# EAGLE design Led_amp (EAGLE 9.6.0)
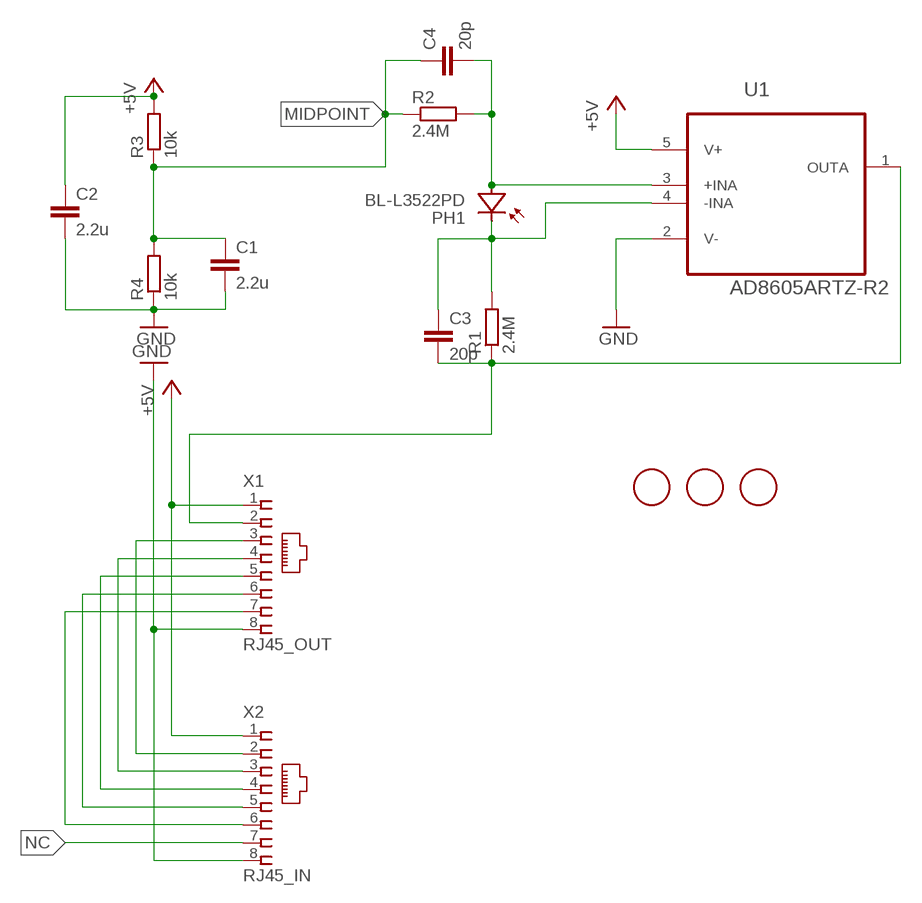
[diagram p0: schematic, sheet 1]

## Parts
C1  2.2u  C-EUC0805  [C0805]
C2  2.2u  C-EUC0805  [C0805]
C3  20p  C-EUC0805  [C0805]
C4  20p  C-EUC0805  [C0805]
PH1  BL-L3522PD  [PDOTODIODE_RECT]
R1  2.4M  R-EU_R0805  [R0805]
R2  2.4M  R-EU_R0805  [R0805]
R3  10k  R-EU_R0805  [R0805]
R4  10k  R-EU_R0805  [R0805]
U1  AD8605ARTZ-R2  [SOT95P290X145-5N]
U$1  FIDUCIALLARGE_1MM  [FIDUCIAL_1MM_LARGE]
U$2  FIDUCIALLARGE_1MM  [FIDUCIAL_1MM_LARGE]
U$3  FIDUCIALLARGE_1MM  [FIDUCIAL_1MM_LARGE]
X1  RJ45_OUT  RJ45DS1134  [DS1134]
X2  RJ45_IN  RJ45DS1134  [DS1134]

## Nets
+5V: C2.1 R3.2 U1.5(V+) X1.1 X2.1
GND: C1.2 C2.2 R4.1 U1.2(V-) X1.8 X2.8
IN+: C4.2 PH1.A R2.2 U1.3(+INA)
IN-: C3.1 PH1.K(C) R1.2 U1.4(-INA)
MIDPOINT: C1.1 C4.1 R2.1 R3.1 R4.2
NC: X2.7
OUT: C3.2 R1.1 U1.1(OUTA) X1.2
OUT2: X1.3 X2.2
OUT3: X1.4 X2.3
OUT4: X1.5 X2.4
OUT5: X1.6 X2.5
OUT6: X1.7 X2.6

## Library data of the parts
C1-C4 = rcl:C-EU: CAPACITOR, European symbol; SPICEPREFIX: C
PH1 = LedAmp:BL-L3522PD
R1-R4 = rcl:R-EU_: RESISTOR, European symbol; SPICEPREFIX: R
U1 = AD8605ARTZ-R2:AD8605ARTZ-R2: Precision, Low Noise, CMOS, RRIO Op Amp; AVAILABILITY: Unavailable; DESCRIPTION: General Purpose Amplifier 1 Circuit Rail-to-Rail SOT-23-5; MF: Analog Devices; MP: AD8605ARTZ-REEL7; PACKAGE: SOT-23-5 Analog Devices; PRICE: None
U$1-U$3 = LedAmp:FIDUCIAL: For use by pick and place machines to calibrate the vision/machine, 1mm By microbuilder.eu
X1 X2 = LedAmp:RJ45: CORCOM Modular RJ Jacks No Shield Source: www.tycoelectronics.com .. ENG_DS_1654001_1099_RJ_L_0507.pdf

## Board
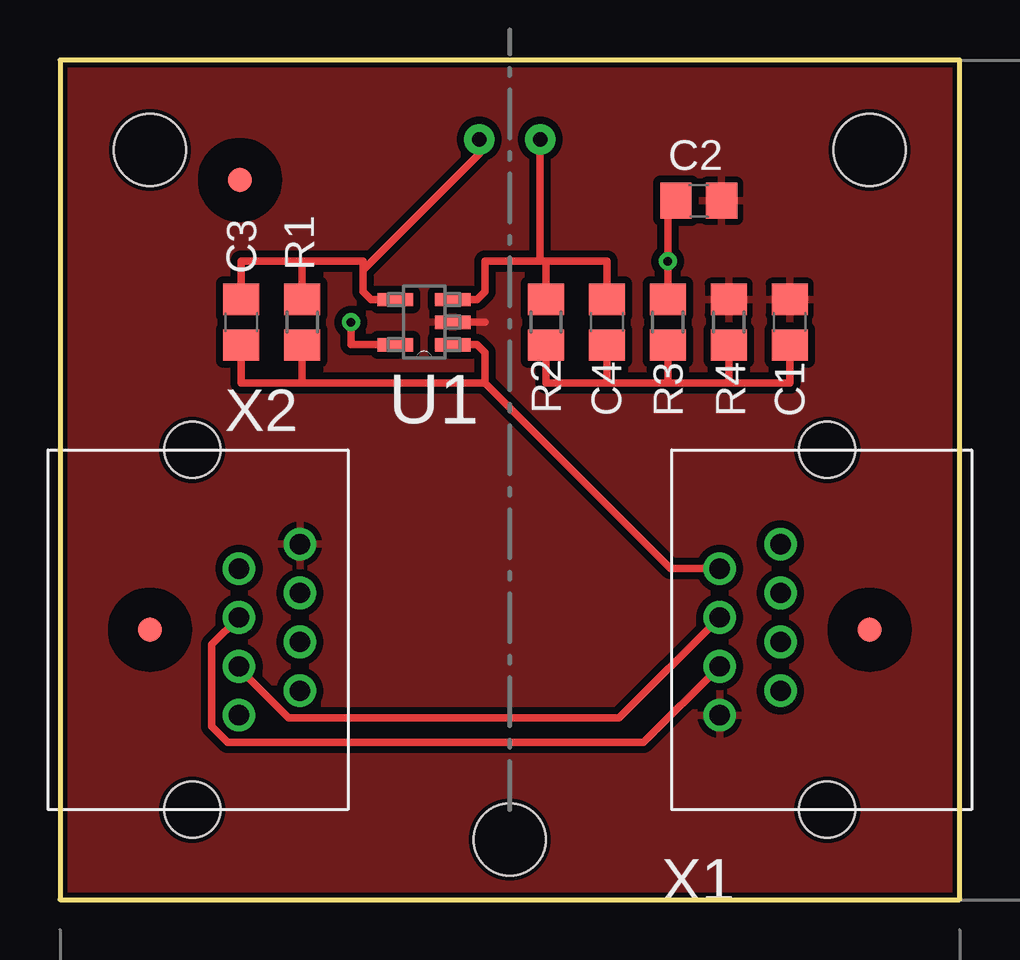
[diagram p1: board, top side]
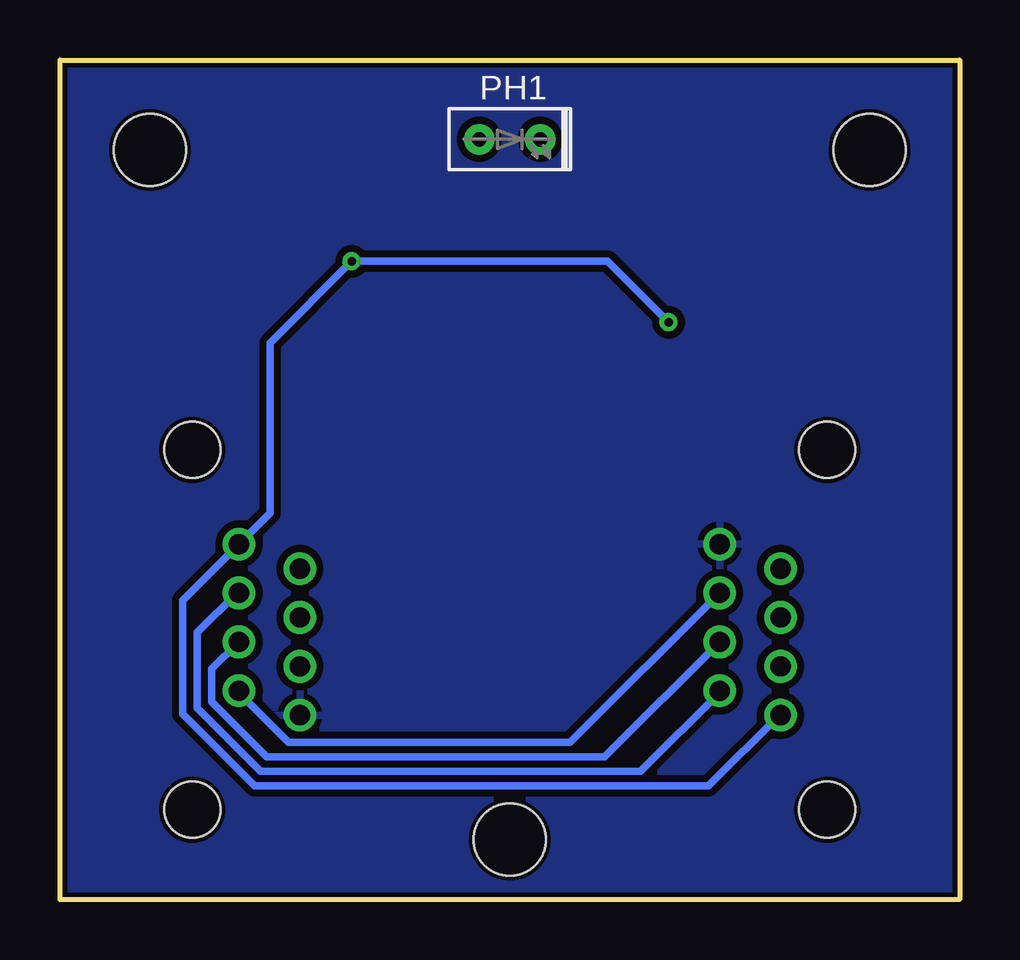
[diagram p2: board, bottom side, seen from below]

Size 37.5 x 35 mm. Coordinates in mm from the lower left corner, seen from the top.
Outline: 0,0 37.5,0 37.5,35 0,35 0,0
Copper layers (1*16): Top 0.035mm / dielectric 1.5mm / Bottom 0.035mm
Design rules "new_default_JLC *": minimum track width 0.3mm, minimum drill 0.35mm, track to track 0.3mm, track to pad 0.3mm, pad to pad 0.3mm, via to via 0.3mm, smd to smd 0.2mm, copper to edge 0.2mm, drill to drill 0.2mm, minimum pad ring 10mil, minimum via ring 8mil, stop-mask expansion 4mil, vias tented up to drill 0.35mm, thermal gap 10mil
Holes 3 mm at 18.75,2.5 3.75,31.25 33.75,31.25

### Footprints (pad centres in the part's own frame; a part is rotated, then mirrored left to right if it is on the bottom)
C0805 = smd 1.3 x 1.5: 1 -0.95,0; 2 0.95,0
PDOTODIODE_RECT = drill 0.6 pad 1.27: A -1.27,0; K 1.27,0
R0805 = smd 1.3 x 1.5: 1 -0.95,0; 2 0.95,0
SOT95P290X145-5N = smd 1.473 x 0.559: 1 -1.194,0.94; 2 -1.194,0; 3 -1.194,-0.94; 4 1.194,-0.94; 5 1.194,0.94
FIDUCIAL_1MM_LARGE = smd 1 x 1: 1 0,0
DS1134 = drill 0.85: 1 3.57,-2.54; 2 2.55,0; 3 1.53,-2.54; 4 0.51,0; 5 -0.51,-2.54; 6 -1.53,0; 7 -2.55,-2.54; 8 -3.57,0 | hole 2.35: 7.5,-4.48; -7.5,-4.48

### Placement (x,y rotation side)
C1  30.42,24.07 90 top
C2  26.63,29.13 0 top
C3  7.56,24.07 270 top
C4  22.8,24.07 90 top
PH1  18.75,31.69 0 bottom
R1  10.1,24.07 90 top
R2  20.26,24.07 90 top
R3  25.34,24.07 90 top
R4  27.88,24.07 270 top
U1  15.18,24.07 180 top
U$1  3.75,11.25 0 top
U$2  33.75,11.25 0 top
U$3  7.5,30 0 top
X1  27.5,11.25 90 top
X2  10,11.25 270 top

### Tracks (layer width: path | path; a pad name or v marks a point on that pad's centre or on a via)
+5V  (via drill 0.35)
  Top 0.305: R3.2 v25.34,26.61 25.34,29.13 C2.1 | U1.5 12.13,23.13 v12.13,24.07
  Bottom 0.305: v12.13,24.07 14.67,26.61 v25.34,26.61 28.75,23.2 28.75,16.11 X1.1 32.38,12.48 32.38,7.73 29.39,4.73 10.46,4.73 7.51,7.68 X2.1
GND
  Top 0.305: U1.2 17.72,24.07
  pour Top (isolate 0.2): 0,35 0,0 37.5,0 37.5,35
  pour Bottom (isolate 0.2): 0,35 0,0 37.5,0 37.5,35
IN+
  Top 0.305: U1.3 17.39,25.01 17.72,25.34 17.72,26.61 20,26.61 | R2.2 20.26,26.61 | 20.26,26.61 20,26.61 | C4.2 22.8,26.61 20.26,26.61 | PH1.A 20.02,26.63 20,26.61
IN-
  Top 0.305: U1.4 12.97,25.01 12.64,25.34 12.64,26.25 | 12.64,26.25 12.64,26.61 10.1,26.61 | R1.2 10.1,26.61 | 10.1,26.61 7.56,26.61 C3.1 | 12.64,26.25 17.48,31.09 PH1.K
MIDPOINT
  Top 0.305: R2.1 20.26,21.53 22.8,21.53 | 22.8,21.53 25.34,21.53 | 25.34,21.53 27.88,21.53 | 27.88,21.53 30.42,21.53 C1.1 | R4.2 27.88,21.53 | R3.1 25.34,21.53 | C4.1 22.8,21.53
OUT
  Top 0.305: R1.1 10.1,21.53 | 17.72,21.53 10.1,21.53 | U1.1 17.39,23.13 17.72,22.8 17.72,21.53 | C3.2 7.56,21.53 10.1,21.53 | X1.2 25.45,13.8 17.72,21.53
OUT2
  Bottom 0.305: X2.2 10,8.63 13.3,5.34 29.13,5.34 31.78,7.98 31.78,11.13 30.12,12.78 X1.3
OUT3
  Top 0.305: X1.4 23.31,7.57 9.53,7.57 7.46,9.64 X2.3
OUT4
  Bottom 0.305: X1.5 31.17,9.61 31.17,8.23 28.88,5.94 14.8,5.94 X2.4
OUT5
  Top 0.305: X1.6 24.33,6.55 6.99,6.55 6.33,7.21 6.33,10.63 X2.5
OUT6
  Bottom 0.305: X1.7 30.04,8.62 27.97,6.55 16.23,6.55 X2.6